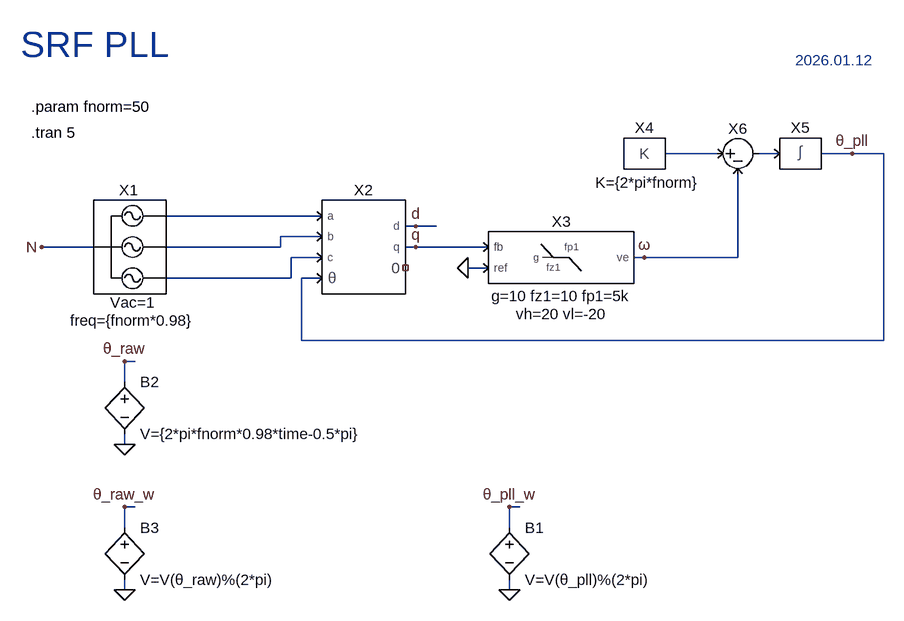
[diagram p0: schematic SRF_PLL.asc]
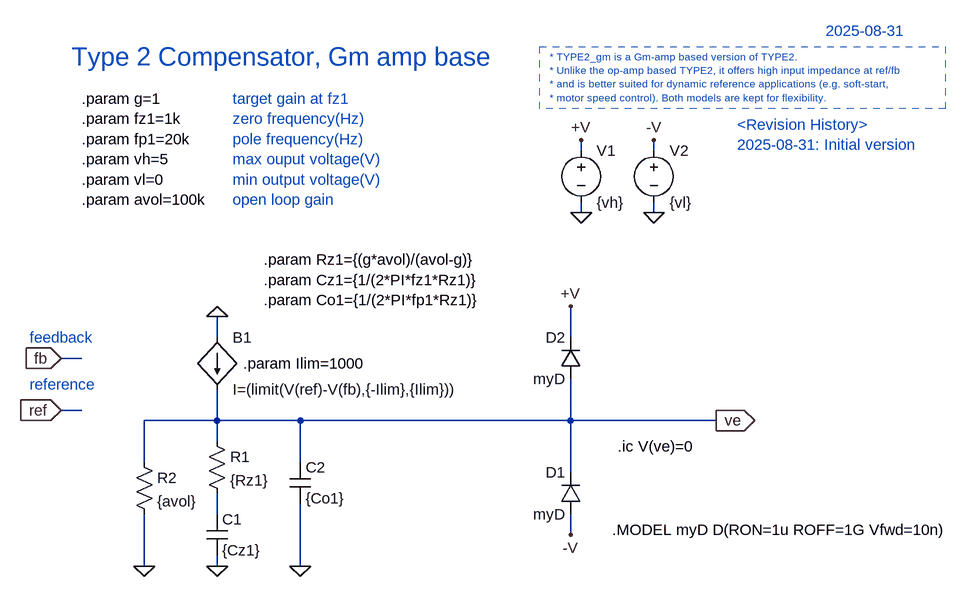
[diagram p1: sub-circuit type2_gm.asc]
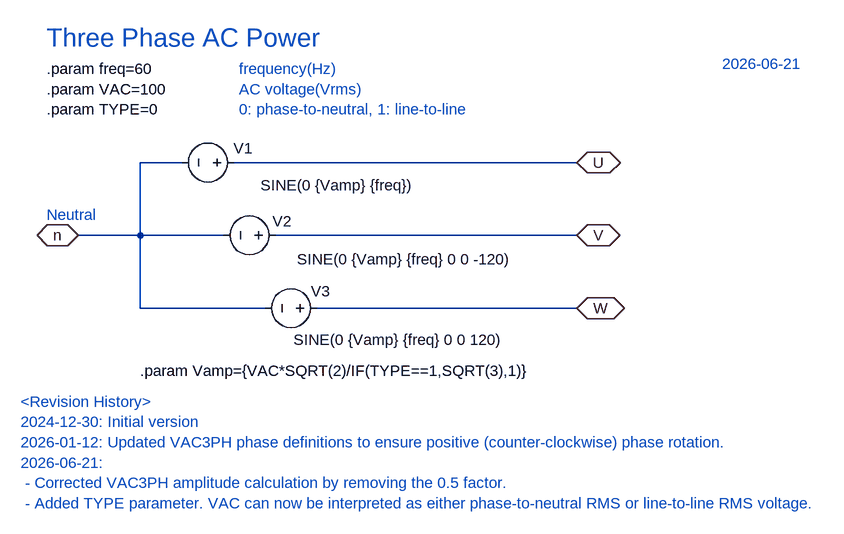
[diagram p2: sub-circuit vac3ph.asc]
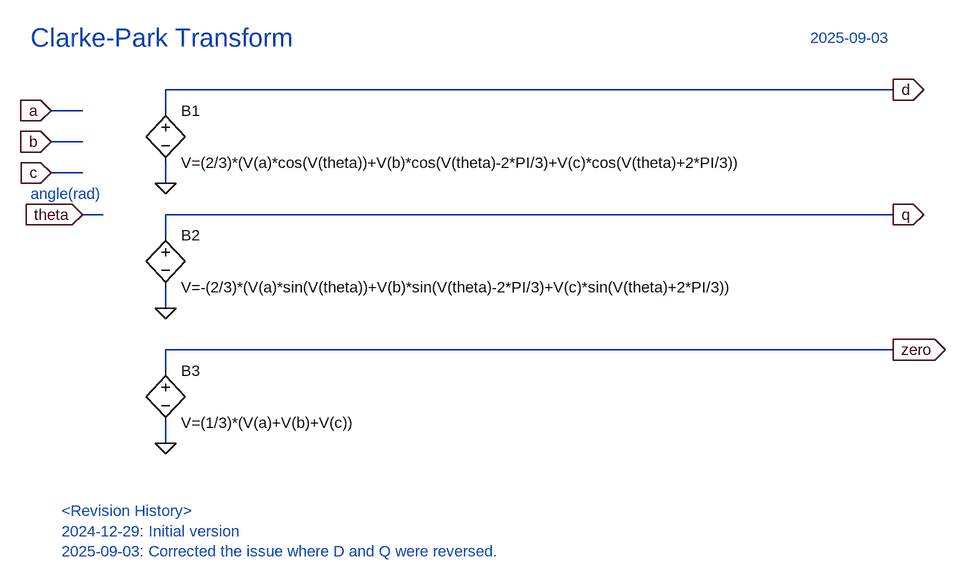
[diagram p3: sub-circuit clarke_park.asc]
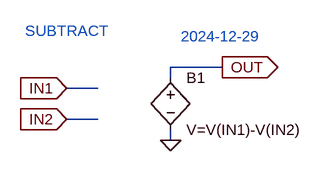
[diagram p4: sub-circuit sub.asc]
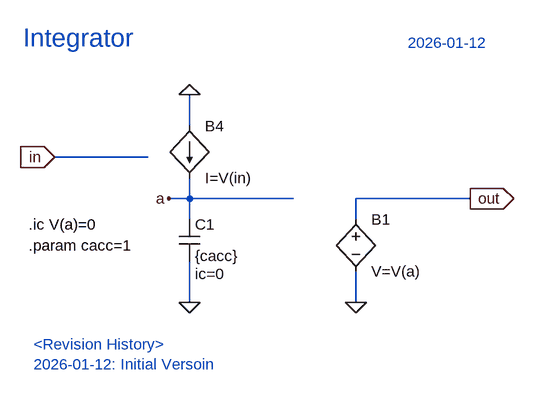
[diagram p5: sub-circuit integrator.asc]
SRF_PLL.asc, the LTspice schematic file:
Version 4.1
SHEET 1 2644 972
WIRE 1328 -80 1248 -80
WIRE 1424 -80 1392 -80
WIRE 1536 -80 1488 -80
WIRE 1584 -80 1536 -80
WIRE 720 16 480 16
WIRE 864 32 848 32
WIRE 896 32 864 32
WIRE 720 48 656 48
WIRE 368 64 288 64
WIRE 656 64 656 48
WIRE 656 64 480 64
WIRE 864 64 848 64
WIRE 976 64 864 64
WIRE 720 80 672 80
WIRE 1216 80 1200 80
WIRE 1360 80 1360 -48
WIRE 1360 80 1216 80
WIRE 976 96 944 96
WIRE 672 112 672 80
WIRE 672 112 480 112
WIRE 720 112 688 112
WIRE 688 208 688 112
WIRE 1584 208 1584 -80
WIRE 1584 208 688 208
WIRE 432 240 416 240
WIRE 416 272 416 240
WIRE 416 368 416 352
WIRE 432 464 416 464
WIRE 1024 464 1008 464
WIRE 416 496 416 464
WIRE 1008 496 1008 464
WIRE 416 592 416 576
WIRE 1008 592 1008 576
FLAG 1536 -80 θ_pll
FLAG 288 64 N
FLAG 1008 592 0
FLAG 1008 464 θ_pll_w
FLAG 1216 80 ω
FLAG 416 368 0
FLAG 416 240 θ_raw
FLAG 864 32 d
FLAG 864 64 q
FLAG 416 592 0
FLAG 416 464 θ_raw_w
FLAG 944 96 0
SYMBOL PowerSim\\CONST 1216 -80 R0
WINDOW 39 4 60 Bottom 2
SYMATTR SpiceLine K={2*pi*fnorm}
SYMATTR InstName X4
SYMBOL PowerSim\\TYPE2_gm 1088 80 R0
WINDOW 39 0 75 Bottom 2
WINDOW 40 0 103 Bottom 2
SYMATTR SpiceLine g=10 fz1=10 fp1=5k
SYMATTR SpiceLine2 vh=20 vl=-20
SYMATTR InstName X3
SYMBOL VAC3ph 432 64 R0
WINDOW 39 -4 101 Bottom 2
WINDOW 40 -4 129 Bottom 2
SYMATTR SpiceLine Vac=1
SYMATTR SpiceLine2 freq={fnorm*0.98}
SYMATTR InstName X1
SYMBOL PowerSim\\CLARKE_PARK 784 64 R0
SYMATTR InstName X2
SYMBOL bv 1008 480 R0
SYMATTR InstName B1
SYMATTR Value V=V(θ_pll)%(2*pi)
SYMBOL bv 416 256 R0
SYMATTR InstName B2
SYMATTR Value V={2*pi*fnorm*0.98*time-0.5*pi}
SYMBOL bv 416 480 R0
SYMATTR InstName B3
SYMATTR Value V=V(θ_raw)%(2*pi)
SYMBOL PowerSim\\SUB 1360 -80 R0
SYMATTR InstName X6
SYMBOL PowerSim\\INTEGRATOR 1456 -80 R0
SYMATTR InstName X5
TEXT 272 -152 Left 2 !.param fnorm=50
TEXT 272 -112 Left 2 !.tran 5
TEXT 256 -248 Left 5 ;SRF PLL
TEXT 1448 -224 Left 2 ;2026.01.12

type2_gm.asc, the sub-circuit schematic file:
Version 4.1
SHEET 1 1136 680
WIRE 432 -144 432 -160
WIRE 544 -144 544 -160
WIRE 432 -48 432 -64
WIRE 544 -48 544 -64
WIRE -128 144 -128 112
WIRE 416 144 416 96
WIRE -336 176 -368 176
WIRE -336 256 -368 256
WIRE -128 272 -128 224
WIRE -128 272 -240 272
WIRE 0 272 -128 272
WIRE 416 272 416 208
WIRE 416 272 0 272
WIRE 640 272 416 272
WIRE -128 304 -128 272
WIRE -240 336 -240 272
WIRE 0 336 0 272
WIRE 416 352 416 272
WIRE -128 416 -128 384
WIRE 416 448 416 416
WIRE -240 496 -240 416
WIRE -128 496 -128 480
WIRE 0 496 0 400
FLAG 640 272 ve
IOPIN 640 272 Out
FLAG -128 496 0
FLAG -240 496 0
FLAG 0 496 0
FLAG -128 112 0
FLAG 544 -48 0
FLAG 432 -48 0
FLAG 432 -160 +V
FLAG 544 -160 -V
FLAG 416 448 -V
FLAG 416 96 +V
FLAG -368 176 fb
IOPIN -368 176 In
FLAG -368 256 ref
IOPIN -368 256 In
SYMBOL bi -128 144 R0
SYMATTR InstName B1
SYMATTR Value I=(limit(V(ref)-V(fb),{-Ilim},{Ilim}))
SYMBOL res -144 288 R0
SYMATTR InstName R1
SYMATTR Value {Rz1}
SYMBOL cap -144 416 R0
SYMATTR InstName C1
SYMATTR Value {Cz1}
SYMBOL res -256 320 R0
SYMATTR InstName R2
SYMATTR Value {avol}
SYMBOL cap -16 336 R0
SYMATTR InstName C2
SYMATTR Value {Co1}
SYMBOL diode 432 416 R180
WINDOW 0 24 64 Left 2
WINDOW 3 24 0 Left 2
SYMATTR InstName D1
SYMATTR Value myD
SYMBOL voltage 432 -160 R0
SYMATTR InstName V1
SYMATTR Value {vh}
SYMBOL voltage 544 -160 R0
WINDOW 123 0 0 Left 0
WINDOW 39 24 44 Left 2
SYMATTR InstName V2
SYMATTR Value {vl}
SYMBOL diode 432 208 R180
WINDOW 0 24 64 Left 2
WINDOW 3 24 0 Left 2
SYMATTR InstName D2
SYMATTR Value myD
TEXT -336 -224 Left 2 !.param g=1\n.param fz1=1k\n.param fp1=20k\n.param vh=5\n.param vl=0\n.param avol=100k
TEXT -352 -288 Left 4 ;Type 2 Compensator, Gm amp base
TEXT -104 -224 Left 2 ;target gain at fz1\nzero frequency(Hz)\npole frequency(Hz)\nmax ouput voltage(V)\nmin output voltage(V)\nopen loop gain
TEXT 808 -328 Left 2 ;2025-08-31
TEXT -56 24 Left 2 !.param Rz1={(g*avol)/(avol-g)}\n.param Cz1={1/(2*PI*fz1*Rz1)}\n.param Co1={1/(2*PI*fp1*Rz1)}
TEXT 488 312 Left 2 !.ic V(ve)=0
TEXT 480 440 Left 2 !.MODEL myD D(RON=1u ROFF=1G Vfwd=10n)
TEXT -88 184 Left 2 !.param Ilim=1000
TEXT 672 -184 Left 2 ;<Revision History>\n2025-08-31: Initial version
TEXT -416 144 Left 2 ;feedback
TEXT -416 216 Left 2 ;reference
TEXT 384 -288 Left 1 ;* TYPE2_gm is a Gm-amp based version of TYPE2.\n* Unlike the op-amp based TYPE2, it offers high input impedance at ref/fb\n* and is better suited for dynamic reference applications (e.g. soft-start,\n* motor speed control). Both models are kept for flexibility.
RECTANGLE Normal 992 -208 368 -304 2

vac3ph.asc, the sub-circuit schematic file:
Version 4.1
SHEET 1 1264 876
WIRE 128 112 64 112
WIRE 736 112 208 112
WIRE 64 224 64 112
WIRE 64 224 -32 224
WIRE 192 224 64 224
WIRE 736 224 272 224
WIRE 64 336 64 224
WIRE 256 336 64 336
WIRE 736 336 336 336
FLAG 736 112 U
IOPIN 736 112 BiDir
FLAG -32 224 n
IOPIN -32 224 BiDir
FLAG 736 336 W
IOPIN 736 336 BiDir
FLAG 736 224 V
IOPIN 736 224 BiDir
SYMBOL voltage 224 112 R90
WINDOW 3 35 -262 VRight 2
WINDOW 123 0 0 Left 0
WINDOW 39 0 0 Left 0
WINDOW 0 -22 -13 VRight 2
SYMATTR Value SINE(0 {Vamp} {freq})
SYMATTR InstName V1
SYMBOL voltage 288 224 R90
WINDOW 3 37 -350 VRight 2
WINDOW 123 0 0 Left 0
WINDOW 39 0 0 Left 0
WINDOW 0 -22 -9 VRight 2
SYMATTR Value SINE(0 {Vamp} {freq} 0 0 -120)
SYMATTR InstName V2
SYMBOL voltage 352 336 M270
WINDOW 3 -49 52 VLeft 2
WINDOW 123 0 0 Left 0
WINDOW 39 0 0 Left 0
WINDOW 0 26 25 VLeft 2
SYMATTR Value SINE(0 {Vamp} {freq} 0 0 120)
SYMATTR InstName V3
TEXT -80 -32 Left 2 !.param freq=60\n.param VAC=100\n.param TYPE=0
TEXT -80 -80 Left 4 ;Three Phase AC Power
TEXT -80 192 Left 2 ;Neutral
TEXT 64 432 Left 2 !.param Vamp={VAC*SQRT(2)/IF(TYPE==1,SQRT(3),1)}
TEXT 216 -32 Left 2 ;frequency(Hz)\nAC voltage(Vrms)\n0: phase-to-neutral, 1: line-to-line
TEXT 960 -40 Left 2 ;2026-06-21
TEXT -120 480 Left 2 ;<Revision History>\n2024-12-30: Initial version\n2026-01-12: Updated VAC3PH phase definitions to ensure positive (counter-clockwise) phase rotation.\n2026-06-21: \n - Corrected VAC3PH amplitude calculation by removing the 0.5 factor. \n - Added TYPE parameter. VAC can now be interpreted as either phase-to-neutral RMS or line-to-line RMS voltage.

clarke_park.asc, the sub-circuit schematic file:
Version 4.1
SHEET 1 1500 816
WIRE 1392 96 272 96
WIRE 144 128 96 128
WIRE 272 128 272 96
WIRE 144 176 96 176
WIRE 144 224 96 224
WIRE 272 240 272 208
WIRE 176 288 144 288
WIRE 1392 288 272 288
WIRE 272 320 272 288
WIRE 272 432 272 400
WIRE 1392 496 272 496
WIRE 272 528 272 496
WIRE 272 640 272 608
FLAG 96 128 a
IOPIN 96 128 In
FLAG 96 176 b
IOPIN 96 176 In
FLAG 1392 96 d
IOPIN 1392 96 Out
FLAG 272 240 0
FLAG 96 224 c
IOPIN 96 224 In
FLAG 144 288 theta
IOPIN 144 288 In
FLAG 1392 288 q
IOPIN 1392 288 Out
FLAG 272 432 0
FLAG 1392 496 zero
IOPIN 1392 496 Out
FLAG 272 640 0
SYMBOL bv 272 112 R0
SYMATTR InstName B1
SYMATTR Value V=(2/3)*(V(a)*cos(V(theta))+V(b)*cos(V(theta)-2*PI/3)+V(c)*cos(V(theta)+2*PI/3))
SYMBOL bv 272 304 R0
SYMATTR InstName B2
SYMATTR Value V=-(2/3)*(V(a)*sin(V(theta))+V(b)*sin(V(theta)-2*PI/3)+V(c)*sin(V(theta)+2*PI/3))
SYMBOL bv 272 512 R0
SYMATTR InstName B3
SYMATTR Value V=(1/3)*(V(a)+V(b)+V(c))
TEXT 64 16 Left 4 ;Clarke-Park Transform
TEXT 1264 16 Left 2 ;2025-09-03
TEXT 64 256 Left 2 ;angle(rad)
TEXT 112 744 Left 2 ;<Revision History>\n2024-12-29: Initial version\n2025-09-03: Corrected the issue where D and Q were reversed.

sub.asc, the sub-circuit schematic file:
Version 4
SHEET 1 880 680
WIRE 288 96 208 96
WIRE 208 112 208 96
WIRE 96 128 48 128
WIRE 96 176 48 176
WIRE 208 208 208 192
FLAG 48 128 IN1
IOPIN 48 128 In
FLAG 48 176 IN2
IOPIN 48 176 In
FLAG 208 208 0
FLAG 288 96 OUT
IOPIN 288 96 Out
SYMBOL bv 208 96 R0
SYMATTR InstName B1
SYMATTR Value V=V(IN1)-V(IN2)
TEXT -16 40 Left 2 ;SUBTRACT
TEXT 224 48 Left 2 ;2024-12-29

integrator.asc, the sub-circuit schematic file:
Version 4.1
SHEET 1 2304 924
WIRE 704 -64 704 -112
WIRE 640 -16 496 -16
WIRE 704 48 704 16
WIRE 704 48 672 48
WIRE 864 48 704 48
WIRE 1136 48 960 48
WIRE 704 80 704 48
WIRE 960 80 960 48
WIRE 704 208 704 144
WIRE 960 208 960 160
FLAG 496 -16 in
IOPIN 496 -16 In
FLAG 704 -112 0
FLAG 704 208 0
FLAG 1136 48 out
IOPIN 1136 48 Out
FLAG 672 48 a
FLAG 960 208 0
SYMBOL cap 688 80 R0
WINDOW 123 24 84 Left 2
SYMATTR Value2 ic=0
SYMATTR InstName C1
SYMATTR Value {cacc}
SYMBOL bv 960 64 R0
SYMATTR InstName B1
SYMATTR Value V=V(a)
SYMBOL bi 704 -64 R0
SYMATTR InstName B4
SYMATTR Value I=V(in)
TEXT 448 -200 Left 4 ;Integrator
TEXT 1040 -192 Left 2 ;2026-01-12
TEXT 464 272 Left 2 ;<Revision History>\n2026-01-12: Initial Versoin
TEXT 456 120 Left 2 !.param cacc=1
TEXT 456 88 Left 2 !.ic V(a)=0

The netlist it stands for:
* SRF_PLL.asc
X§X4 N001 CONST K={2*pi*fnorm}  ; pins K
X§X3 q 0 ω type2_gm params: avol=100k g=10 fz1=10 fp1=5k vh=20 vl=-20
X§X1 N N003 N004 N005 vac3ph params: type=0 Vac=1 freq={fnorm*0.98}
X§X2 N003 N004 N005 θ_pll NC_01 d q clarke_park
B1 θ_pll_w 0 V=V(θ_pll)%(2*pi)
B2 θ_raw 0 V={2*pi*fnorm*0.98*time-0.5*pi}
B3 θ_raw_w 0 V=V(θ_raw)%(2*pi)
X§X6 N001 ω N002 sub
X§X5 N002 θ_pll integrator

* block symbol definitions
.subckt type2_gm fb ref ve
B1 0 ve I=(limit(V(ref)-V(fb),{-Ilim},{Ilim}))
R1 ve N001 {Rz1}
C1 N001 0 {Cz1}
R2 ve 0 {avol}
C2 ve 0 {Co1}
D1 -V ve myD
V1 +V 0 {vh}
V2 -V 0 {vl}
D2 ve +V myD
.param g=1
.param fz1=1k
.param fp1=20k
.param vh=5
.param vl=0
.param avol=100k
* Type 2 Compensator, Gm amp base
* target gain at fz1
* zero frequency(Hz)
* pole frequency(Hz)
* max ouput voltage(V)
* min output voltage(V)
* open loop gain
* 2025-08-31
.param Rz1={(g*avol)/(avol-g)}
.param Cz1={1/(2*PI*fz1*Rz1)}
.param Co1={1/(2*PI*fp1*Rz1)}
.ic V(ve)=0
.MODEL myD D(RON=1u ROFF=1G Vfwd=10n)
.param Ilim=1000
* <Revision History>
* 2025-08-31: Initial version
* feedback
* reference
* * TYPE2_gm is a Gm-amp based version of TYPE2.
* * Unlike the op-amp based TYPE2, it offers high input impedance at ref/fb
* * and is better suited for dynamic reference applications (e.g. soft-start,
* * motor speed control). Both models are kept for flexibility.
.ends type2_gm

.subckt vac3ph n U V W
V1 U n SINE(0 {Vamp} {freq})
V2 V n SINE(0 {Vamp} {freq} 0 0 -120)
V3 W n SINE(0 {Vamp} {freq} 0 0 120)
.param freq=60
.param VAC=100
.param TYPE=0
* Three Phase AC Power
* Neutral
.param Vamp={VAC*SQRT(2)/IF(TYPE==1,SQRT(3),1)}
* frequency(Hz)
* AC voltage(Vrms)
* 0: phase-to-neutral, 1: line-to-line
* 2026-06-21
* <Revision History>
* 2024-12-30: Initial version
* 2026-01-12: Updated VAC3PH phase definitions to ensure positive (counter-clockwise) phase rotation.
* 2026-06-21:
*  - Corrected VAC3PH amplitude calculation by removing the 0.5 factor.
*  - Added TYPE parameter. VAC can now be interpreted as either phase-to-neutral RMS or line-to-line RMS voltage.
.ends vac3ph

.subckt clarke_park a b c theta zero d q
B1 d 0 V=(2/3)*(V(a)*cos(V(theta))+V(b)*cos(V(theta)-2*PI/3)+V(c)*cos(V(theta)+2*PI/3))
B2 q 0 V=-(2/3)*(V(a)*sin(V(theta))+V(b)*sin(V(theta)-2*PI/3)+V(c)*sin(V(theta)+2*PI/3))
B3 zero 0 V=(1/3)*(V(a)+V(b)+V(c))
* Clarke-Park Transform
* 2025-09-03
* angle(rad)
* <Revision History>
* 2024-12-29: Initial version
* 2025-09-03: Corrected the issue where D and Q were reversed.
.ends clarke_park

.subckt sub in1 in2 out
B1 OUT 0 V=V(IN1)-V(IN2)
* SUBTRACT
* 2024-12-29
.ends sub

.subckt integrator in out
C1 a 0 {cacc} ic=0
B1 out 0 V=V(a)
B4 0 a I=V(in)
* Integrator
* 2026-01-12
* <Revision History>
* 2026-01-12: Initial Versoin
.param cacc=1
.ic V(a)=0
.ends integrator

.model D D
.lib standard.dio
.param fnorm=50
.tran 5
* SRF PLL
* 2026.01.12
.backanno
.end